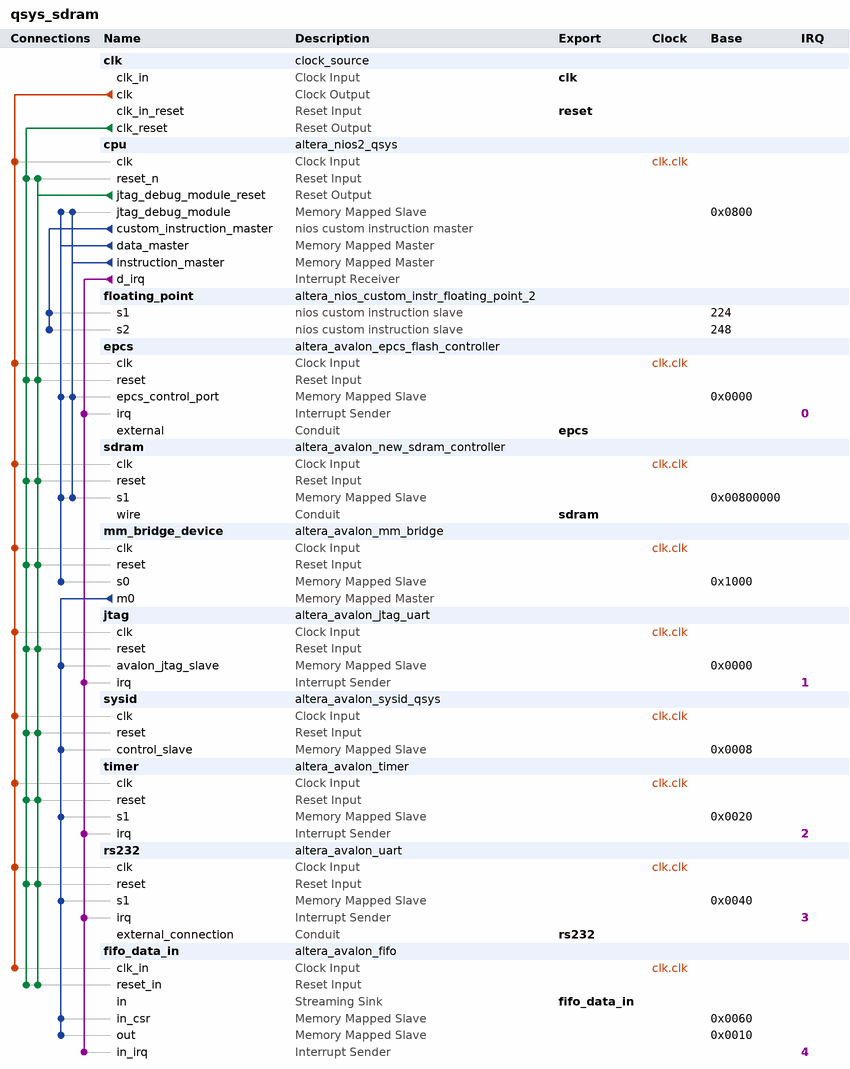
[diagram p0: system contents]
# Platform Designer (Qsys) system qsys_sdram, Cyclone III EP3C25F324C8
# Parameters at their usual value, and those the tool derives, are not listed.
package require -exact qsys 13.1
create_system qsys_sdram
set_project_property DEVICE_FAMILY {Cyclone III}
set_project_property DEVICE EP3C25F324C8

add_instance clk clock_source 13.1
set_instance_parameter_value clk clockFrequency 50000000

add_instance cpu altera_nios2_qsys 13.1
set_instance_parameter_value cpu muldiv_divider true
set_instance_parameter_value cpu resetSlave epcs.epcs_control_port
set_instance_parameter_value cpu mmu_TLBMissExcSlave None
set_instance_parameter_value cpu exceptionSlave sdram.s1
set_instance_parameter_value cpu breakSlave cpu.jtag_debug_module
set_instance_parameter_value cpu impl Fast
set_instance_parameter_value cpu icache_size 4096

add_instance floating_point altera_nios_custom_instr_floating_point_2 100.99.98.97

add_instance epcs altera_avalon_epcs_flash_controller 13.1

add_instance sdram altera_avalon_new_sdram_controller 13.1
set_instance_parameter_value sdram TAC 6.0
set_instance_parameter_value sdram TRCD 20.0
set_instance_parameter_value sdram TRP 20.0
set_instance_parameter_value sdram TWR 26.0
set_instance_parameter_value sdram casLatency 3
set_instance_parameter_value sdram columnWidth 8
set_instance_parameter_value sdram dataWidth 16
set_instance_parameter_value sdram generateSimulationModel false
set_instance_parameter_value sdram model single_Micron_MT48LC4M32B2_7_chip
set_instance_parameter_value sdram numberOfBanks 4
set_instance_parameter_value sdram numberOfChipSelects 1
set_instance_parameter_value sdram powerUpDelay 100.0
set_instance_parameter_value sdram refreshPeriod 15.625
set_instance_parameter_value sdram rowWidth 12

add_instance mm_bridge_device altera_avalon_mm_bridge 13.1
set_instance_parameter_value mm_bridge_device DATA_WIDTH 32
set_instance_parameter_value mm_bridge_device ADDRESS_WIDTH 8
set_instance_parameter_value mm_bridge_device ADDRESS_UNITS SYMBOLS
set_instance_parameter_value mm_bridge_device MAX_PENDING_RESPONSES 32

add_instance jtag altera_avalon_jtag_uart 13.1
set_instance_parameter_value jtag simInteractiveOptions NO_INTERACTIVE_WINDOWS

add_instance sysid altera_avalon_sysid_qsys 13.1
set_instance_parameter_value sysid id 0

add_instance timer altera_avalon_timer 13.1
set_instance_parameter_value timer alwaysRun true
set_instance_parameter_value timer fixedPeriod true
set_instance_parameter_value timer period 20
set_instance_parameter_value timer periodUnits MSEC
set_instance_parameter_value timer snapshot false

add_instance rs232 altera_avalon_uart 13.1
set_instance_parameter_value rs232 baud 115200
set_instance_parameter_value rs232 dataBits 8
set_instance_parameter_value rs232 fixedBaud true
set_instance_parameter_value rs232 parity NONE
set_instance_parameter_value rs232 stopBits 1

add_instance fifo_data_in altera_avalon_fifo 13.1
set_instance_parameter_value fifo_data_in bitsPerSymbol 32
set_instance_parameter_value fifo_data_in channelWidth 0
set_instance_parameter_value fifo_data_in errorWidth 0
set_instance_parameter_value fifo_data_in fifoDepth 256
set_instance_parameter_value fifo_data_in fifoInputInterfaceOptions AVALONST_SINK
set_instance_parameter_value fifo_data_in fifoOutputInterfaceOptions AVALONMM_READ
set_instance_parameter_value fifo_data_in singleClockMode true
set_instance_parameter_value fifo_data_in symbolsPerBeat 1
set_instance_parameter_value fifo_data_in useBackpressure false
set_instance_parameter_value fifo_data_in useIRQ true
set_instance_parameter_value fifo_data_in usePacket false
set_instance_parameter_value fifo_data_in useReadControl false

# connections
add_connection clk.clk cpu.clk clock
add_connection clk.clk epcs.clk clock
add_connection clk.clk fifo_data_in.clk_in clock
add_connection clk.clk jtag.clk clock
add_connection clk.clk mm_bridge_device.clk clock
add_connection clk.clk rs232.clk clock
add_connection clk.clk sdram.clk clock
add_connection clk.clk sysid.clk clock
add_connection clk.clk timer.clk clock
add_connection clk.clk_reset cpu.reset_n reset
add_connection clk.clk_reset epcs.reset reset
add_connection clk.clk_reset fifo_data_in.reset_in reset
add_connection clk.clk_reset jtag.reset reset
add_connection clk.clk_reset mm_bridge_device.reset reset
add_connection clk.clk_reset rs232.reset reset
add_connection clk.clk_reset sdram.reset reset
add_connection clk.clk_reset sysid.reset reset
add_connection clk.clk_reset timer.reset reset
add_connection cpu.jtag_debug_module_reset cpu.reset_n reset
add_connection cpu.jtag_debug_module_reset epcs.reset reset
add_connection cpu.jtag_debug_module_reset fifo_data_in.reset_in reset
add_connection cpu.jtag_debug_module_reset jtag.reset reset
add_connection cpu.jtag_debug_module_reset mm_bridge_device.reset reset
add_connection cpu.jtag_debug_module_reset rs232.reset reset
add_connection cpu.jtag_debug_module_reset sdram.reset reset
add_connection cpu.jtag_debug_module_reset sysid.reset reset
add_connection cpu.jtag_debug_module_reset timer.reset reset
add_connection cpu.data_master cpu.jtag_debug_module avalon
set_connection_parameter_value cpu.data_master/cpu.jtag_debug_module baseAddress 0x0800
add_connection cpu.data_master epcs.epcs_control_port avalon
set_connection_parameter_value cpu.data_master/epcs.epcs_control_port baseAddress 0x0000
add_connection cpu.data_master mm_bridge_device.s0 avalon
set_connection_parameter_value cpu.data_master/mm_bridge_device.s0 baseAddress 0x1000
add_connection cpu.data_master sdram.s1 avalon
set_connection_parameter_value cpu.data_master/sdram.s1 baseAddress 0x00800000
add_connection cpu.instruction_master cpu.jtag_debug_module avalon
set_connection_parameter_value cpu.instruction_master/cpu.jtag_debug_module baseAddress 0x0800
add_connection cpu.instruction_master epcs.epcs_control_port avalon
set_connection_parameter_value cpu.instruction_master/epcs.epcs_control_port baseAddress 0x0000
add_connection cpu.instruction_master sdram.s1 avalon
set_connection_parameter_value cpu.instruction_master/sdram.s1 baseAddress 0x00800000
add_connection mm_bridge_device.m0 fifo_data_in.in_csr avalon
set_connection_parameter_value mm_bridge_device.m0/fifo_data_in.in_csr baseAddress 0x0060
add_connection mm_bridge_device.m0 fifo_data_in.out avalon
set_connection_parameter_value mm_bridge_device.m0/fifo_data_in.out baseAddress 0x0010
add_connection mm_bridge_device.m0 jtag.avalon_jtag_slave avalon
set_connection_parameter_value mm_bridge_device.m0/jtag.avalon_jtag_slave baseAddress 0x0000
add_connection mm_bridge_device.m0 rs232.s1 avalon
set_connection_parameter_value mm_bridge_device.m0/rs232.s1 baseAddress 0x0040
add_connection mm_bridge_device.m0 sysid.control_slave avalon
set_connection_parameter_value mm_bridge_device.m0/sysid.control_slave baseAddress 0x0008
add_connection mm_bridge_device.m0 timer.s1 avalon
set_connection_parameter_value mm_bridge_device.m0/timer.s1 baseAddress 0x0020
add_connection cpu.d_irq epcs.irq interrupt
set_connection_parameter_value cpu.d_irq/epcs.irq irqNumber 0
add_connection cpu.d_irq fifo_data_in.in_irq interrupt
set_connection_parameter_value cpu.d_irq/fifo_data_in.in_irq irqNumber 4
add_connection cpu.d_irq jtag.irq interrupt
set_connection_parameter_value cpu.d_irq/jtag.irq irqNumber 1
add_connection cpu.d_irq rs232.irq interrupt
set_connection_parameter_value cpu.d_irq/rs232.irq irqNumber 3
add_connection cpu.d_irq timer.irq interrupt
set_connection_parameter_value cpu.d_irq/timer.irq irqNumber 2
add_connection cpu.custom_instruction_master floating_point.s1 nios_custom_instruction
set_connection_parameter_value cpu.custom_instruction_master/floating_point.s1 CIName floating_point
set_connection_parameter_value cpu.custom_instruction_master/floating_point.s1 baseAddress 224
add_connection cpu.custom_instruction_master floating_point.s2 nios_custom_instruction
set_connection_parameter_value cpu.custom_instruction_master/floating_point.s2 CIName floating_point_1
set_connection_parameter_value cpu.custom_instruction_master/floating_point.s2 baseAddress 248

# exported interfaces
add_interface clk clock sink
set_interface_property clk EXPORT_OF clk.clk_in
add_interface reset reset sink
set_interface_property reset EXPORT_OF clk.clk_in_reset
add_interface epcs conduit end
set_interface_property epcs EXPORT_OF epcs.external
add_interface sdram conduit end
set_interface_property sdram EXPORT_OF sdram.wire
add_interface rs232 conduit end
set_interface_property rs232 EXPORT_OF rs232.external_connection
add_interface fifo_data_in avalon_streaming sink
set_interface_property fifo_data_in EXPORT_OF fifo_data_in.in

set_interconnect_requirement {$system} qsys_mm.clockCrossingAdapter HANDSHAKE
set_interconnect_requirement {$system} qsys_mm.maxAdditionalLatency 1
set_interconnect_requirement {$system} qsys_mm.insertDefaultSlave false

save_system qsys_sdram.qsys
